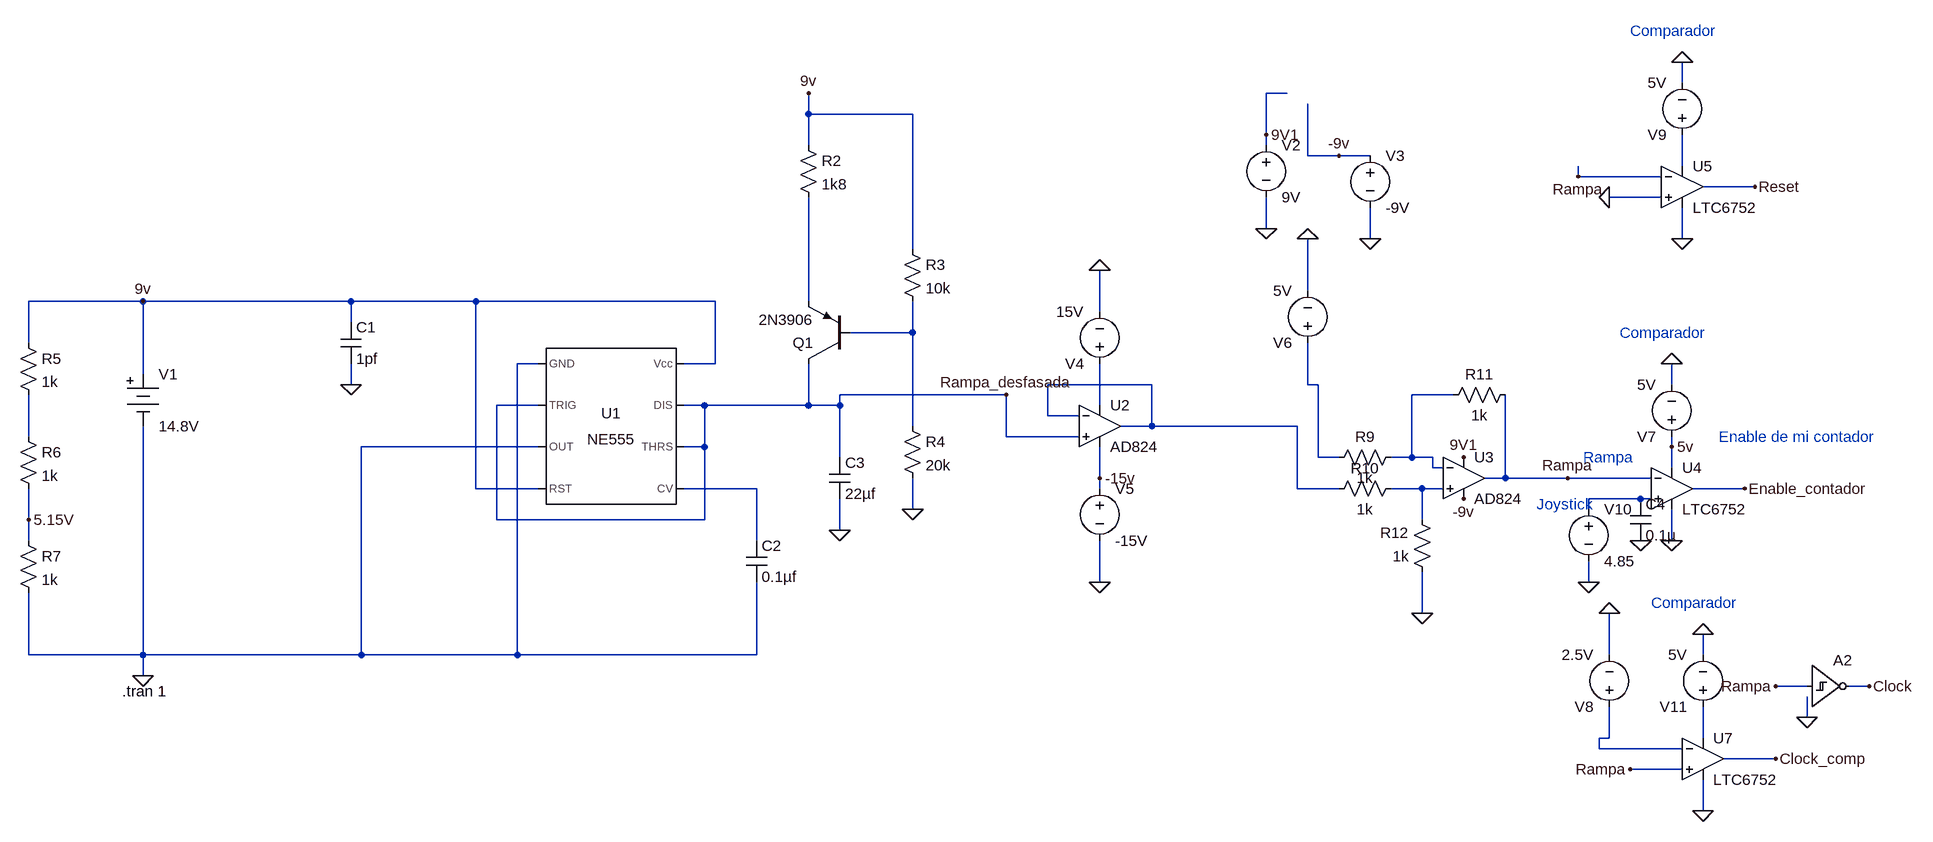
[diagram p0: schematic Joystick.asc]
Joystick.asc, the LTspice schematic file:
Version 4
SHEET 1 3624 1080
WIRE 1872 -512 1872 -544
WIRE 1264 -496 1232 -496
WIRE 528 -464 528 -496
WIRE 688 -464 528 -464
WIRE 1232 -432 1232 -496
WIRE 528 -416 528 -464
WIRE 1232 -416 1232 -432
WIRE 1296 -400 1296 -480
WIRE 1344 -400 1296 -400
WIRE 1392 -400 1344 -400
WIRE 1872 -384 1872 -432
WIRE 1712 -368 1712 -384
WIRE 1840 -368 1712 -368
WIRE 1984 -352 1904 -352
WIRE 1840 -336 1760 -336
WIRE 1232 -288 1232 -336
WIRE 1392 -272 1392 -320
WIRE 1872 -272 1872 -320
WIRE 688 -256 688 -464
WIRE 1296 -192 1296 -272
WIRE -496 -176 -672 -176
WIRE -176 -176 -496 -176
WIRE 16 -176 -176 -176
WIRE 384 -176 16 -176
WIRE 528 -176 528 -336
WIRE 976 -160 976 -224
WIRE -176 -144 -176 -176
WIRE 688 -128 688 -176
WIRE 688 -128 592 -128
WIRE -672 -112 -672 -176
WIRE 112 -80 80 -80
WIRE 384 -80 384 -176
WIRE 384 -80 336 -80
WIRE -496 -64 -496 -176
WIRE -176 -48 -176 -80
WIRE 1056 -48 896 -48
WIRE 1296 -48 1296 -112
WIRE 1312 -48 1296 -48
WIRE 1856 -48 1856 -80
WIRE 832 -32 576 -32
WIRE 1520 -32 1456 -32
WIRE 112 -16 48 -16
WIRE 368 -16 336 -16
WIRE 528 -16 528 -80
WIRE 528 -16 368 -16
WIRE 576 -16 576 -32
WIRE 576 -16 528 -16
WIRE 976 -16 976 -80
WIRE 896 0 896 -48
WIRE 944 0 896 0
WIRE 688 16 688 -128
WIRE 1056 16 1056 -48
WIRE 1056 16 1008 16
WIRE 1280 16 1056 16
WIRE -672 32 -672 -32
WIRE 832 32 832 -32
WIRE 944 32 832 32
WIRE 112 48 -160 48
WIRE 368 48 368 -16
WIRE 368 48 336 48
WIRE 1856 48 1856 32
WIRE 576 64 576 -16
WIRE 1312 64 1312 -48
WIRE 1344 64 1312 64
WIRE 1456 64 1456 -32
WIRE 1456 64 1424 64
WIRE 1488 64 1456 64
WIRE 1488 80 1488 64
WIRE 1504 80 1488 80
WIRE 1856 80 1856 48
WIRE 976 96 976 48
WIRE 1600 96 1600 -32
WIRE 1600 96 1568 96
WIRE 1696 96 1600 96
WIRE 1824 96 1696 96
WIRE 16 112 16 -176
WIRE 112 112 16 112
WIRE 448 112 336 112
WIRE 976 112 976 96
WIRE 1280 112 1280 16
WIRE 1344 112 1280 112
WIRE 1472 112 1424 112
WIRE 1504 112 1472 112
WIRE 1968 112 1888 112
WIRE 1808 128 1728 128
WIRE 1824 128 1808 128
WIRE 688 144 688 96
WIRE 1728 144 1728 128
WIRE -672 160 -672 112
WIRE 48 160 48 -16
WIRE 368 160 368 48
WIRE 368 160 48 160
WIRE 1472 160 1472 112
WIRE 576 176 576 128
WIRE -672 192 -672 160
WIRE 448 192 448 112
WIRE 1856 192 1856 144
WIRE 976 256 976 192
WIRE 1728 256 1728 224
WIRE 1472 304 1472 240
WIRE -672 368 -672 272
WIRE -496 368 -496 16
WIRE -496 368 -672 368
WIRE -160 368 -160 48
WIRE -160 368 -496 368
WIRE 80 368 80 -80
WIRE 80 368 -160 368
WIRE 448 368 448 256
WIRE 448 368 80 368
WIRE 1760 368 1760 304
WIRE 1904 368 1904 336
WIRE -496 400 -496 368
WIRE 2064 416 2016 416
WIRE 2160 416 2128 416
WIRE 2064 464 2064 432
WIRE 1760 496 1760 448
WIRE 1760 496 1744 496
WIRE 1904 496 1904 448
WIRE 1744 512 1744 496
WIRE 1872 512 1744 512
WIRE 2016 528 1936 528
WIRE 1872 544 1792 544
WIRE 1904 608 1904 560
FLAG -496 400 0
FLAG -176 -48 0
FLAG -496 -176 9v
FLAG 528 -496 9v
FLAG 576 176 0
FLAG 688 144 0
FLAG 1232 -288 0
FLAG 976 -224 0
FLAG 976 256 0
FLAG 1472 304 0
FLAG 1296 -272 0
FLAG 1344 -400 -9v
FLAG 1536 128 -9v
FLAG 1232 -432 9V1
FLAG 1536 64 9V1
FLAG 976 96 -15v
FLAG 1392 -272 0
FLAG 1856 192 0
FLAG 1856 -80 0
FLAG 1760 304 0
FLAG 1856 48 5v
FLAG 1696 96 Rampa
FLAG 1968 112 Enable_contador
FLAG 1872 -272 0
FLAG 1872 -544 0
FLAG 1984 -352 Reset
FLAG 1712 -368 Rampa
FLAG -672 160 5.15V
FLAG 1760 -336 0
FLAG 832 -32 Rampa_desfasada
FLAG 1808 192 0
FLAG 1904 608 0
FLAG 1904 336 0
FLAG 1792 544 Rampa
FLAG 1728 256 0
FLAG 2160 416 Clock
FLAG 2016 416 Rampa
FLAG 2064 464 0
FLAG 2016 528 Clock_comp
SYMBOL Misc\\NE555 224 16 R0
SYMATTR InstName U1
SYMBOL Misc\\battery -496 -80 R0
WINDOW 123 0 0 Left 0
WINDOW 39 0 0 Left 0
SYMATTR InstName V1
SYMATTR Value 14.8V
SYMBOL cap 432 192 R0
SYMATTR InstName C2
SYMATTR Value 0.1µf
SYMBOL cap -192 -144 R0
SYMATTR InstName C1
SYMATTR Value 1pf
SYMBOL pnp 592 -80 R180
SYMATTR InstName Q1
SYMATTR Value 2N3906
SYMBOL res 512 -432 R0
SYMATTR InstName R2
SYMATTR Value 1k8
SYMBOL cap 560 64 R0
SYMATTR InstName C3
SYMATTR Value 22µf
SYMBOL res 672 -272 R0
SYMATTR InstName R3
SYMATTR Value 10k
SYMBOL res 672 0 R0
SYMATTR InstName R4
SYMATTR Value 20k
SYMBOL Opamps\\AD824 976 -48 R0
SYMATTR InstName U2
SYMBOL voltage 1232 -432 R0
WINDOW 123 0 0 Left 0
WINDOW 39 0 0 Left 0
SYMATTR InstName V2
SYMATTR Value 9V
SYMBOL voltage 1392 -416 R0
WINDOW 123 0 0 Left 0
WINDOW 39 0 0 Left 0
SYMATTR InstName V3
SYMATTR Value -9V
SYMBOL voltage 976 -64 R180
WINDOW 123 0 0 Left 0
WINDOW 39 0 0 Left 0
SYMATTR InstName V4
SYMATTR Value 15V
SYMBOL voltage 976 96 R0
WINDOW 123 0 0 Left 0
WINDOW 39 0 0 Left 0
SYMATTR InstName V5
SYMATTR Value -15V
SYMBOL Opamps\\AD824 1536 32 R0
SYMATTR InstName U3
SYMBOL res 1440 48 R90
WINDOW 0 0 56 VBottom 2
WINDOW 3 32 56 VTop 2
SYMATTR InstName R9
SYMATTR Value 1k
SYMBOL res 1440 96 R90
WINDOW 0 0 56 VBottom 2
WINDOW 3 32 56 VTop 2
SYMATTR InstName R10
SYMATTR Value 1k
SYMBOL res 1616 -48 R90
WINDOW 0 0 56 VBottom 2
WINDOW 3 32 56 VTop 2
SYMATTR InstName R11
SYMATTR Value 1k
SYMBOL res 1488 256 R180
WINDOW 0 36 76 Left 2
WINDOW 3 36 40 Left 2
SYMATTR InstName R12
SYMATTR Value 1k
SYMBOL voltage 1296 -96 R180
WINDOW 123 0 0 Left 0
WINDOW 39 0 0 Left 0
SYMATTR InstName V6
SYMATTR Value 5V
SYMBOL voltage 1856 48 R180
WINDOW 123 0 0 Left 0
WINDOW 39 0 0 Left 0
SYMATTR InstName V7
SYMATTR Value 5V
SYMBOL voltage 1760 464 R180
WINDOW 123 0 0 Left 0
WINDOW 39 0 0 Left 0
SYMATTR InstName V8
SYMATTR Value 2.5V
SYMBOL Comparators\\LTC6752 1856 48 R0
SYMATTR InstName U4
SYMBOL voltage 1872 -416 R180
WINDOW 123 0 0 Left 0
WINDOW 39 0 0 Left 0
SYMATTR InstName V9
SYMATTR Value 5V
SYMBOL Comparators\\LTC6752 1872 -416 R0
SYMATTR InstName U5
SYMBOL res -688 -128 R0
SYMATTR InstName R5
SYMATTR Value 1k
SYMBOL res -688 16 R0
SYMATTR InstName R6
SYMATTR Value 1k
SYMBOL res -688 176 R0
SYMATTR InstName R7
SYMATTR Value 1k
SYMBOL cap 1792 128 R0
SYMATTR InstName C4
SYMATTR Value 0.1µ
SYMBOL voltage 1904 464 R180
WINDOW 123 0 0 Left 0
WINDOW 39 0 0 Left 0
SYMATTR InstName V11
SYMATTR Value 5V
SYMBOL Comparators\\LTC6752 1904 464 R0
SYMATTR InstName U7
SYMBOL voltage 1728 128 R0
WINDOW 123 0 0 Left 0
WINDOW 39 0 0 Left 0
SYMATTR InstName V10
SYMATTR Value 4.85
SYMBOL Digital\\schmtinv 2064 352 R0
SYMATTR InstName A2
SYMATTR Value2 Vhigh=5 Ref=2.5
TEXT 1776 -128 Left 2 ;Comparador
TEXT 1720 64 Left 2 ;Rampa
TEXT 1648 136 Left 2 ;Joystick
TEXT 1928 32 Left 2 ;Enable de mi contador
TEXT -528 424 Left 2 !.tran 1
TEXT 1792 -592 Left 2 ;Comparador
TEXT 1824 288 Left 2 ;Comparador

The netlist it stands for:
* Joystick.asc
XU1 0 Rampa_desfasada 0 9v N009 Rampa_desfasada Rampa_desfasada 9v NE555  ; pins GND TRIG OUT RST CV THRS DIS Vcc
V1 9v 0 14.8V
C2 N009 0 0.1µf
C1 9v 0 1pf
Q1 Rampa_desfasada N003 N002 0 2N3906
R2 9v N002 1k8
C3 Rampa_desfasada 0 22µf
R3 9v N003 10k
R4 N003 0 20k
XU2 Rampa_desfasada N004 N007 -15v N004 AD824  ; pins In+ In- V+ V- OUT
V2 9V1 0 9V
V3 -9v 0 -9V
V4 N007 0 15V
V5 -15v 0 -15V
XU3 N010 N006 9V1 -9v Rampa AD824  ; pins In+ In- V+ V- OUT
R9 N006 N005 1k
R10 N010 N004 1k
R11 Rampa N006 1k
R12 0 N010 1k
V6 N005 0 5V
V7 5v 0 5V
V8 N012 0 2.5V
XU4 N011 Rampa 5v 0 Enable_contador LTC6752  ; pins In+ In- V+ V- OUT
V9 N001 0 5V
XU5 0 Rampa N001 0 Reset LTC6752  ; pins In+ In- V+ V- OUT
R5 9v N008 1k
R6 N008 5.15V 1k
R7 5.15V 0 1k
C4 N011 0 0.1µ
V11 N013 0 5V
XU7 Rampa N012 N013 0 Clock_comp LTC6752  ; pins In+ In- V+ V- OUT
V10 N011 0 4.85
A2 Rampa 0 0 0 0 Clock 0 0 SCHMITT Vhigh=5 Ref=2.5
.model NPN NPN
.model PNP PNP
.lib standard.bjt
* Comparador
* Rampa
* Joystick
* Enable de mi contador
.tran 1
* Comparador
* Comparador
.lib NE555.sub
.lib LTC7.lib
.backanno
.end